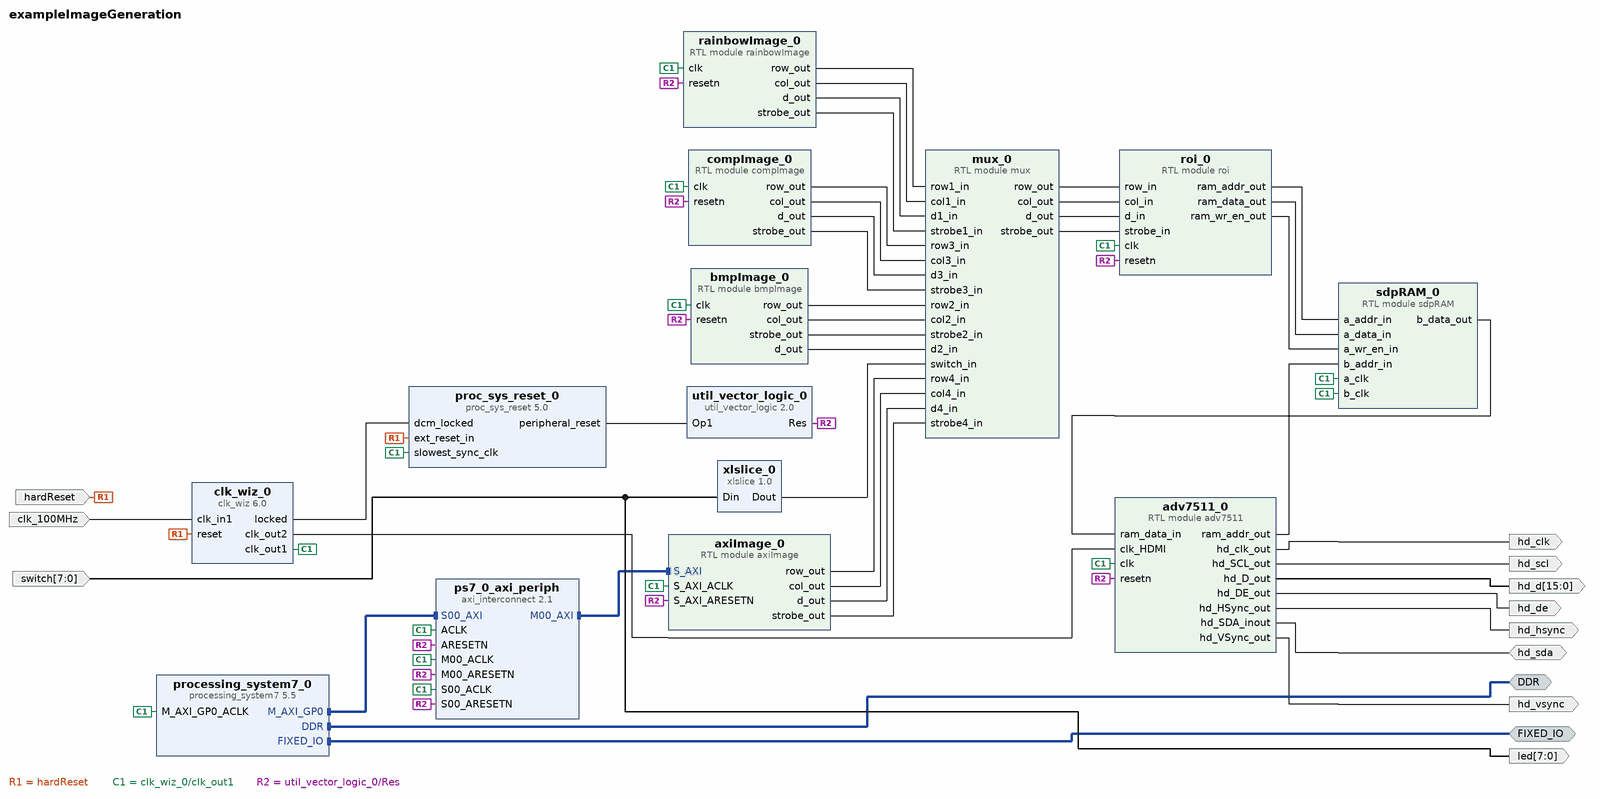
[diagram p0: block diagram of the top level]
# Vivado block design exampleImageGeneration, xc7z020clg484-1, Vivado 2019.1
create_bd_design exampleImageGeneration

create_bd_intf_port -mode Master -vlnv xilinx.com:interface:ddrx_rtl:1.0 DDR
create_bd_intf_port -mode Master -vlnv xilinx.com:display_processing_system7:fixedio_rtl:1.0 FIXED_IO
create_bd_port -dir I -type clk clk_100MHz
create_bd_port -dir I -type rst hardReset
set_property -dict {CONFIG.POLARITY ACTIVE_HIGH} [get_bd_ports hardReset]
create_bd_port -dir O hd_clk
create_bd_port -dir I -from 7 -to 0 switch
create_bd_port -dir O -from 7 -to 0 led
create_bd_port -dir O hd_scl
create_bd_port -dir IO hd_sda
create_bd_port -dir O hd_vsync
create_bd_port -dir O hd_hsync
create_bd_port -dir O -from 15 -to 0 hd_d
create_bd_port -dir O hd_de

create_bd_cell -type module -reference roi roi_0
set_property -dict {CONFIG.colSize_g 8 CONFIG.rowSize_g 8} [get_bd_cells roi_0]
create_bd_cell -type module -reference sdpRAM sdpRAM_0
set_property -dict {CONFIG.addr_width_g 16 CONFIG.data_entries_g 65535 CONFIG.data_width_g 16} [get_bd_cells sdpRAM_0]
create_bd_cell -type ip -vlnv xilinx.com:ip:clk_wiz:6.0 clk_wiz_0
set_property -dict [list \
  CONFIG.CLKOUT1_JITTER 121.476 \
  CONFIG.CLKOUT1_PHASE_ERROR 92.672 \
  CONFIG.CLKOUT1_REQUESTED_OUT_FREQ 110 \
  CONFIG.CLKOUT2_JITTER 106.967 \
  CONFIG.CLKOUT2_PHASE_ERROR 92.672 \
  CONFIG.CLKOUT2_REQUESTED_OUT_FREQ 220 \
  CONFIG.CLKOUT2_USED true \
  CONFIG.MMCM_CLKFBOUT_MULT_F 11.000 \
  CONFIG.MMCM_CLKOUT0_DIVIDE_F 10.000 \
  CONFIG.MMCM_CLKOUT1_DIVIDE 5 \
  CONFIG.NUM_OUT_CLKS 2 \
] [get_bd_cells clk_wiz_0]
create_bd_cell -type ip -vlnv xilinx.com:ip:proc_sys_reset:5.0 proc_sys_reset_0
create_bd_cell -type ip -vlnv xilinx.com:ip:util_vector_logic:2.0 util_vector_logic_0
set_property -dict {CONFIG.C_OPERATION not CONFIG.C_SIZE 1} [get_bd_cells util_vector_logic_0]
create_bd_cell -type module -reference rainbowImage rainbowImage_0
set_property -dict {CONFIG.frameRate_g 60} [get_bd_cells rainbowImage_0]
create_bd_cell -type ip -vlnv xilinx.com:ip:xlslice:1.0 xlslice_0
set_property -dict {CONFIG.DIN_FROM 1 CONFIG.DIN_TO 0 CONFIG.DIN_WIDTH 8 CONFIG.DOUT_WIDTH 2} [get_bd_cells xlslice_0]
create_bd_cell -type module -reference bmpImage bmpImage_0
create_bd_cell -type module -reference mux mux_0
create_bd_cell -type ip -vlnv xilinx.com:ip:processing_system7:5.5 processing_system7_0
set_property -dict [list \
  CONFIG.PCW_APU_PERIPHERAL_FREQMHZ 666.666667 \
  CONFIG.PCW_ENET0_PERIPHERAL_ENABLE 0 \
  CONFIG.PCW_EN_CLK0_PORT 0 \
  CONFIG.PCW_FPGA0_PERIPHERAL_FREQMHZ 100.000000 \
  CONFIG.PCW_FPGA1_PERIPHERAL_FREQMHZ 150.000000 \
  CONFIG.PCW_GPIO_MIO_GPIO_ENABLE 1 \
  CONFIG.PCW_GPIO_MIO_GPIO_IO MIO \
  CONFIG.PCW_I2C_RESET_ENABLE 1 \
  CONFIG.PCW_PRESET_BANK1_VOLTAGE {LVCMOS 1.8V} \
  CONFIG.PCW_QSPI_PERIPHERAL_ENABLE 0 \
  CONFIG.PCW_SD0_GRP_CD_ENABLE 1 \
  CONFIG.PCW_SD0_GRP_CD_IO {MIO 47} \
  CONFIG.PCW_SD0_GRP_WP_ENABLE 1 \
  CONFIG.PCW_SD0_GRP_WP_IO {MIO 46} \
  CONFIG.PCW_SD0_PERIPHERAL_ENABLE 1 \
  CONFIG.PCW_SD0_SD0_IO {MIO 40 .. 45} \
  CONFIG.PCW_SDIO_PERIPHERAL_FREQMHZ 50 \
  CONFIG.PCW_UART1_PERIPHERAL_ENABLE 1 \
  CONFIG.PCW_UART1_UART1_IO {MIO 48 .. 49} \
  CONFIG.PCW_UART_PERIPHERAL_FREQMHZ 50 \
  CONFIG.PCW_UIPARAM_DDR_FREQ_MHZ 533.333313 \
  CONFIG.PCW_UIPARAM_DDR_PARTNO {MT41J128M16 HA-15E} \
  CONFIG.PCW_USB0_PERIPHERAL_ENABLE 0 \
  CONFIG.PCW_USB_RESET_ENABLE 1 \
  CONFIG.preset ZedBoard \
] [get_bd_cells processing_system7_0]
# 227 more settings of processing_system7_0 are not shown: defaults, MIO pin electricals, DDR timing, and values the tool derives
create_bd_cell -type module -reference compImage compImage_0
create_bd_cell -type ip -vlnv xilinx.com:ip:axi_interconnect:2.1 ps7_0_axi_periph
set_property -dict {CONFIG.NUM_MI 1} [get_bd_cells ps7_0_axi_periph]
create_bd_cell -type module -reference axiImage axiImage_0
create_bd_cell -type module -reference adv7511 adv7511_0
set_property -dict {CONFIG.clkFrequency_g 110000000 CONFIG.upscalingFactor_g 4} [get_bd_cells adv7511_0]

# ---- connections ----

connect_bd_intf_net [get_bd_intf_ports DDR] [get_bd_intf_pins processing_system7_0/DDR]
connect_bd_intf_net [get_bd_intf_ports FIXED_IO] [get_bd_intf_pins processing_system7_0/FIXED_IO]
connect_bd_intf_net [get_bd_intf_pins processing_system7_0/M_AXI_GP0] [get_bd_intf_pins ps7_0_axi_periph/S00_AXI]
connect_bd_intf_net [get_bd_intf_pins ps7_0_axi_periph/M00_AXI] [get_bd_intf_pins axiImage_0/S_AXI]
connect_bd_net [get_bd_pins roi_0/ram_addr_out] [get_bd_pins sdpRAM_0/a_addr_in]
connect_bd_net [get_bd_pins roi_0/ram_data_out] [get_bd_pins sdpRAM_0/a_data_in]
connect_bd_net [get_bd_pins roi_0/ram_wr_en_out] [get_bd_pins sdpRAM_0/a_wr_en_in]
connect_bd_net -net clk_in1_0_1 [get_bd_ports clk_100MHz] [get_bd_pins clk_wiz_0/clk_in1]
connect_bd_net -net reset_0_1 [get_bd_ports hardReset] [get_bd_pins clk_wiz_0/reset] [get_bd_pins proc_sys_reset_0/ext_reset_in]
connect_bd_net [get_bd_pins clk_wiz_0/locked] [get_bd_pins proc_sys_reset_0/dcm_locked]
connect_bd_net [get_bd_pins clk_wiz_0/clk_out1] \
  [get_bd_pins proc_sys_reset_0/slowest_sync_clk] [get_bd_pins roi_0/clk] [get_bd_pins sdpRAM_0/a_clk] \
  [get_bd_pins sdpRAM_0/b_clk] [get_bd_pins rainbowImage_0/clk] [get_bd_pins bmpImage_0/clk] [get_bd_pins compImage_0/clk] \
  [get_bd_pins ps7_0_axi_periph/ACLK] [get_bd_pins processing_system7_0/M_AXI_GP0_ACLK] \
  [get_bd_pins ps7_0_axi_periph/S00_ACLK] [get_bd_pins ps7_0_axi_periph/M00_ACLK] [get_bd_pins axiImage_0/S_AXI_ACLK] \
  [get_bd_pins adv7511_0/clk]
connect_bd_net [get_bd_pins proc_sys_reset_0/peripheral_reset] [get_bd_pins util_vector_logic_0/Op1]
connect_bd_net [get_bd_pins util_vector_logic_0/Res] \
  [get_bd_pins roi_0/resetn] [get_bd_pins rainbowImage_0/resetn] [get_bd_pins bmpImage_0/resetn] \
  [get_bd_pins compImage_0/resetn] [get_bd_pins ps7_0_axi_periph/S00_ARESETN] [get_bd_pins ps7_0_axi_periph/M00_ARESETN] \
  [get_bd_pins ps7_0_axi_periph/ARESETN] [get_bd_pins axiImage_0/S_AXI_ARESETN] [get_bd_pins adv7511_0/resetn]
connect_bd_net [get_bd_pins sdpRAM_0/b_data_out] [get_bd_pins adv7511_0/ram_data_in]
connect_bd_net [get_bd_pins adv7511_0/ram_addr_out] [get_bd_pins sdpRAM_0/b_addr_in]
connect_bd_net [get_bd_pins adv7511_0/hd_clk_out] [get_bd_ports hd_clk]
connect_bd_net [get_bd_pins adv7511_0/hd_SCL_out] [get_bd_ports hd_scl]
connect_bd_net [get_bd_ports hd_sda] [get_bd_pins adv7511_0/hd_SDA_inout]
connect_bd_net [get_bd_pins adv7511_0/hd_VSync_out] [get_bd_ports hd_vsync]
connect_bd_net [get_bd_pins adv7511_0/hd_HSync_out] [get_bd_ports hd_hsync]
connect_bd_net [get_bd_pins adv7511_0/hd_DE_out] [get_bd_ports hd_de]
connect_bd_net [get_bd_pins adv7511_0/hd_D_out] [get_bd_ports hd_d]
connect_bd_net [get_bd_ports switch] [get_bd_pins xlslice_0/Din] [get_bd_ports led]
connect_bd_net [get_bd_pins xlslice_0/Dout] [get_bd_pins mux_0/switch_in]
connect_bd_net [get_bd_pins rainbowImage_0/row_out] [get_bd_pins mux_0/row1_in]
connect_bd_net [get_bd_pins rainbowImage_0/col_out] [get_bd_pins mux_0/col1_in]
connect_bd_net [get_bd_pins rainbowImage_0/d_out] [get_bd_pins mux_0/d1_in]
connect_bd_net [get_bd_pins rainbowImage_0/strobe_out] [get_bd_pins mux_0/strobe1_in]
connect_bd_net [get_bd_pins compImage_0/row_out] [get_bd_pins mux_0/row3_in]
connect_bd_net [get_bd_pins compImage_0/col_out] [get_bd_pins mux_0/col3_in]
connect_bd_net [get_bd_pins compImage_0/d_out] [get_bd_pins mux_0/d3_in]
connect_bd_net [get_bd_pins compImage_0/strobe_out] [get_bd_pins mux_0/strobe3_in]
connect_bd_net [get_bd_pins mux_0/row_out] [get_bd_pins roi_0/row_in]
connect_bd_net [get_bd_pins mux_0/col_out] [get_bd_pins roi_0/col_in]
connect_bd_net [get_bd_pins mux_0/d_out] [get_bd_pins roi_0/d_in]
connect_bd_net [get_bd_pins mux_0/strobe_out] [get_bd_pins roi_0/strobe_in]
connect_bd_net [get_bd_pins bmpImage_0/row_out] [get_bd_pins mux_0/row2_in]
connect_bd_net [get_bd_pins bmpImage_0/col_out] [get_bd_pins mux_0/col2_in]
connect_bd_net [get_bd_pins bmpImage_0/strobe_out] [get_bd_pins mux_0/strobe2_in]
connect_bd_net [get_bd_pins bmpImage_0/d_out] [get_bd_pins mux_0/d2_in]
connect_bd_net [get_bd_pins axiImage_0/row_out] [get_bd_pins mux_0/row4_in]
connect_bd_net [get_bd_pins axiImage_0/col_out] [get_bd_pins mux_0/col4_in]
connect_bd_net [get_bd_pins axiImage_0/d_out] [get_bd_pins mux_0/d4_in]
connect_bd_net [get_bd_pins axiImage_0/strobe_out] [get_bd_pins mux_0/strobe4_in]
connect_bd_net [get_bd_pins clk_wiz_0/clk_out2] [get_bd_pins adv7511_0/clk_HDMI]

# ---- address map ----
assign_bd_address -offset 0x43C00000 -range 64K -target_address_space [get_bd_addr_spaces processing_system7_0/Data] [get_bd_addr_segs axiImage_0/S_AXI/reg0]

validate_bd_design
save_bd_design
